# Altium schematic sheet DAC To LP Filter.SchDoc: Audio_Moduloop - DAC/LP-filter
size A; Date: 2/27/2024; DrawnBy: Team 28: Ryan Gordon, Conor Curtin, Evan Roveili, Shawn Colby; DocumentNumber: 3; Revision: V1; SheetNumber: 3; SheetTotal: 9
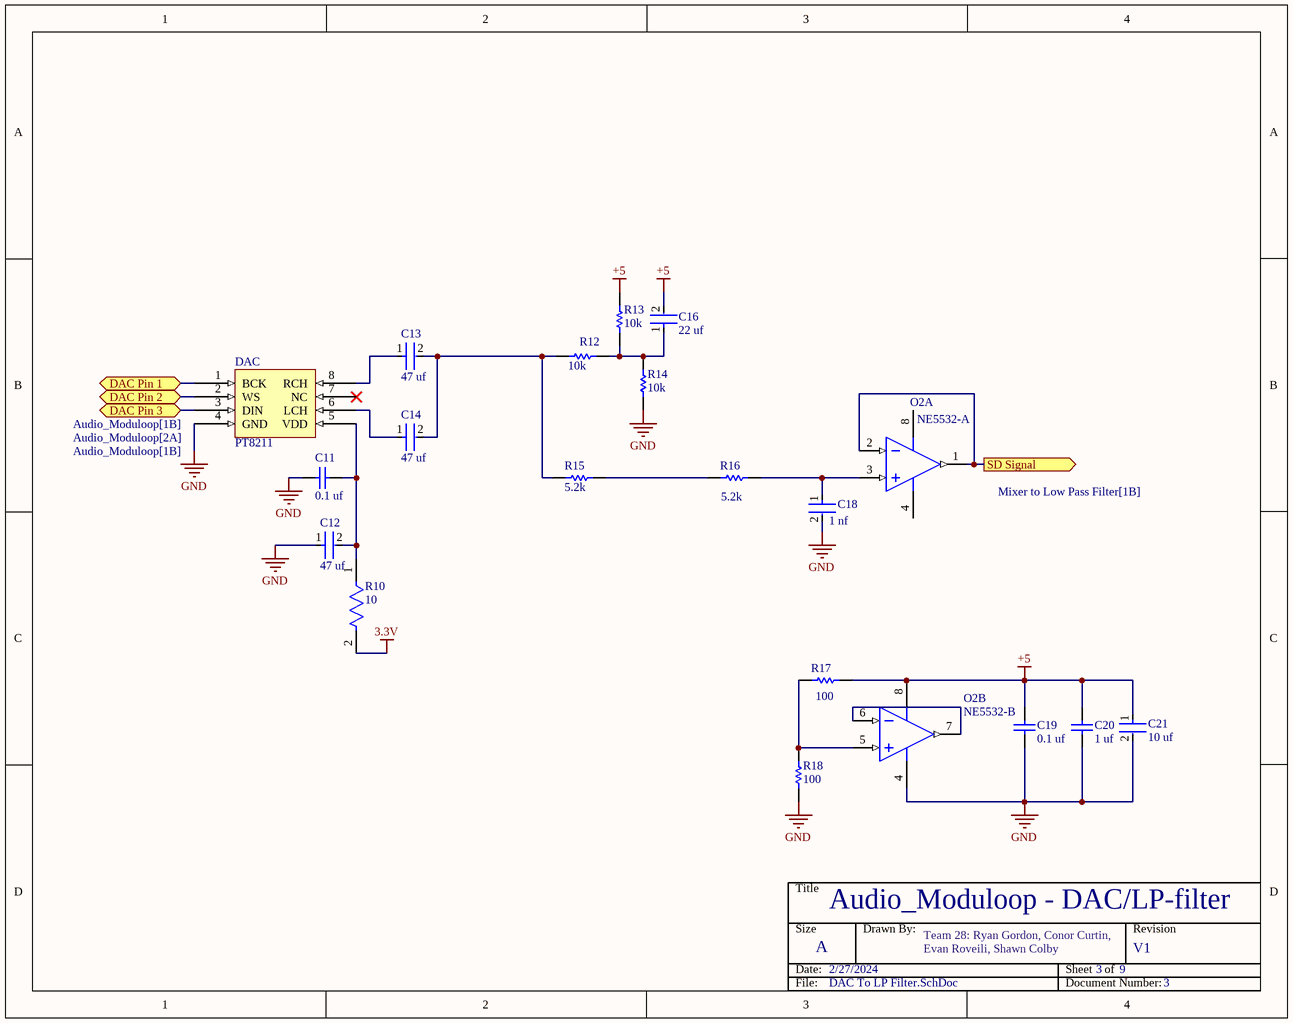
[diagram p0: DAC To LP Filter.SchDoc]

## Parts
C11  0.1 uf  [VISH-K104K15X7RF5TL2]
C12  47 uf  [FP-RCE2A2-MFG]
C13  47 uf  [FP-RCE2A2-MFG]
C14  47 uf  [FP-RCE2A2-MFG]
C16  22 uf  [FP-RCEWM1-MFG]
C18  1 nf  [FP-RCE0DB-MFG]
C19  0.1 uf  [CAPC2013X135X45ML10T25]
C20  1 uf  [CAPC2013X145X50LL20T25]
C21  10 uf  [FP-C0805C-DG-MFG]
DAC  PT8211  [SOIC127P602X173-8N]
O2  NE5532-A  [ONSC-SOIC-8-751-07_V]  (parts A,B of 2)
R10  10  [FP-RN732A-MFG]
R12  10k  [RESC2013X60X35NL10T20]
R13  10k  [RESC2013X60X35NL10T20]
R14  10k  [RESC2013X60X35NL10T20]
R15  5.2k  [RESC2013X70X40LL20T20]
R16  5.2k  [RESC2013X70X40LL20T20]
R17  100  [RESC2013X60X40ML20T25]
R18  100  [RESC2013X60X40ML20T25]

## Ports
DAC Pin 1 (bidir, see Audio_Moduloop[1B]), DAC Pin 2 (bidir, see Audio_Moduloop[1B]), DAC Pin 3 (bidir, see Audio_Moduloop[2A]), SD Signal (out, see Mixer to Low Pass Filter[1B])

## Nets
3.3V: R10.2
+5: C16.2 C19.1 C20.1 C21.1 O2.8(V+) R13.1 R17.2
GND: C11.2 C12.1 C18.2 C19.2 C20.2 C21.2 DAC.4(GND) O2.4(V-) R14.2 R18.1
DAC Pin 1: DAC.1(BCK) ; port DAC Pin 1
DAC Pin 2: DAC.2(WS) ; port DAC Pin 2
DAC Pin 3: DAC.3(DIN) ; port DAC Pin 3
SD Signal: O2.1(OUTA) O2.2(INA-) ; port SD Signal
NetC11_1: C11.1 C12.2 DAC.5(VDD) R10.1
NetC13_1: C13.1 DAC.8(RCH)
NetC13_2: C13.2 C14.2 R12.2 R15.1
NetC14_1: C14.1 DAC.6(LCH)
NetC16_1: C16.1 R12.1 R13.2 R14.1
NetC18_1: C18.1 O2.3(INA+) R16.2
NetO2_5: O2.5(INB+) R17.1 R18.2
NetO2_6: O2.6(INB-) O2.7(OUTB)
NetR15_2: R15.2 R16.1

Not connected (* = marked no-connect by the designer): DAC 7(NC)*

## Notes on the sheet
- Title
- Size
- Date:
- A
- Drawn By:
- Sheet    of
- Revision
- File:
- Document Number:

## Library data of the parts
C11 = CMP-2000-06508-1: Ceramic Capacitor, 100 nF, +/- 10%, 50 V, -55 to 125 degC, 2-Pin THD, RoHS, Tape and Reel; Manufacturer: Vishay; Other Names: BC1084CT; Catalog Drawings: Mono-KapSide2-15_5.58Mono-KapSide1_15; Temperature Coefficient: X7R; Voltage - Rated: 50V; Online Catalog: Mono-Kap™Series; Capacitance: 0.1µF; Size / Dimension: 0.157"Lx0.098"W(4.00mmx2.50mm); Operating Temperature: -55°C~125°C; Family: CeramicCapacitors; Manufacturer URL: http://www.vishay.com/; Standard Package: 1; Thickness (Max): -; Ratings: -; Datasheet Version: 08/2013; Package Description: 2-Pin Through Hole Device, Body 4 x 2.6 mm; Mounting Type: ThroughHole; Features: -; Lead Spacing: 0.098"(2.50mm); Tolerance: ±10%; Category: Capacitors; Mounting Technology: ThroughHole; Lead Style: Straight; Datasheet URL: http://www.vishay.com/docs/45171/kseries.pdf; Applications: GeneralPurpose; Package / Case: Radial; Height - Seated (Max): 0.220"(5.58mm); Package Reference: K104K15X7RF5TL2; Series: Mono-Kap™K; Packaging: CutTape(CT)
C12-C14 = CMP-06035-022497-1: Cap Ceramic 4.7uF 25V X7R ±10% Radial 2.5mm +125°C Automotive Ammo Pack; Lead/Base Style: Straight; Lead Diameter: 0.5mm; Height - Seated (Max): 0.157inch; Voltage Rating (DC): 25V; Height: 4mm; Length: 0.217inch; Max Operating Temperature: 125°C; Ratings: AEC-Q200; Dielectric: X7R; Resistor Type: Ceramic; Packaging: Tape and Reel; Tolerance: 10%; Termination: Radial; Min Operating Temperature: -55°C; Case/Package: Radial; Width: 0.124inch; Lead Pitch: 0.098inch; Package Quantity: 2000; Voltage Rating: 25V; Mount: Through Hole; Capacitance: 4.7uF
C16 = CMP-06035-009422-1: Cap Ceramic 22uF 25V X7R ±20% Radial 5mm +125°C Automotive Ammo Pack; Lead/Base Style: Formed Leads; Lead Diameter: 0.5mm; Packaging: Bulk; Width: 0.157inch; Min Operating Temperature: -55°C; Lead Pitch: 0.197inch; Ratings: AEC-Q200; Length: 0.217inch; Voltage Rating (DC): 25V; Case/Package: Radial; Height - Seated (Max): 0.295inch; Package Quantity: 500; Max Operating Temperature: 125°C; Mount: Through Hole; Resistor Type: Ceramic; Height: 7.5mm; Capacitance: 22uF; Tolerance: 20%; Dielectric: X7R; Voltage Rating: 25V; Termination: Radial
C18 = CMP-06035-009321-1: Cap Ceramic 470pF 100V X7R ±10% Radial 2.5mm +125°C Ammo Pack; Lead Diameter: 0.5mm; Lead/Base Style: Straight; Termination: Radial; Width: 0.098inch; Mount: Through Hole; Package Quantity: 2000; Height - Seated (Max): 0.138inch; Height: 3.5mm; Voltage Rating: 100V; Min Operating Temperature: -55°C; Dielectric: X7R; Max Operating Temperature: 125°C; Voltage Rating (DC): 100V; Capacitance: 470pF; Ratings: AEC-Q200; Packaging: Tape and Reel; Tolerance: 10%; Resistor Type: Ceramic; Lead Pitch: 0.098inch; Case/Package: Radial; Length: 0.142inch
C19 = CMP-2100-03644-1: Chip Capacitor, 0.1 uF, +/- 10%, 50 V, -55 to 125 degC, 0805 (2012 Metric), RoHS, Tape and Reel; Manufacturer: Murata; Voltage: 50V; Capacitance: 100nF; Insulation Resistance: 10GR; Dielectric Material: Ceramic; Dielectric: X7R; Package Description: 2-Pin Surface Mount Device, Body 2 x 1.25 mm; Manufacturer URL: http://www.murata.com/; Case Code (Imperial): 0805; Datasheet URL: http://psearch.en.murata.com/capacitor/product/GRM21BR71H104KA01%23.pdf; Termination: SMD/SMT; Lead Free: LeadFree; Package Quantity: 1; Mount: SurfaceMount; REACH SVHC: Unknown; Thickness: 0.053inch; Height: 1.25mm; Case/Package: 0805; Voltage Rating: 50V; Width: 0.049inch; Case Code (Metric): 2012; Material: Ceramic; Min Operating Temperature: -55degC; RoHSCompliant: true; Datasheet Version: 42675.0; Voltage Rating (DC): 50V; Tolerance: 10%; Package Reference: 0805; Depth: 1.25mm; Length: 2mm; Max Operating Temperature: 125degC; Packaging: TapeandReel; Number of Pins: 2; Radiation Hardening: No
C20 = CMP-1036-04746-2: Manufacturer: Kemet; Part Number: C0805C105K4PACTU
C21 = CMP-2007-03243-2: CAP CER 10UF 10V X5R 0805; Manufacturer Part Number: C0805C106K8PACTU; Manufacturer: Kemet; 3DS Part Number: 220-00001; Tolerance: 10%; Temperature Coefficient: 15%; Material: Ceramic; Device Class L2: Capacitors; Device Class L1: Passive Components; ComponentLink2URL: https://content.kemet.com/datasheets/KEM_C1006_X5R_SMD.pdf; Height: 1.4mm; Lead Free: Yes; Digikey Description: CAP CER 10UF 10V X5R 0805; Octopart: https://octopart.com/c0805c106k8pactu-kemet-98697; Capacitance: 10uF; Value: 10uF; Temperature Range Low: -55°C; Temperature: -55°C to +85°C; Automotive: No; Mouser Description: CAP CER 10UF 10V X5R 0805; Ipc Land Pattern Name: CAPC200125X125; Temperature Range High: +85°C; Voltage: 10V; RoHS: TRUE; Device Class L3: Ceramic Capacitors; ComponentLink2Description: Datasheet; Voltage Rating: 10V; Package: C0805C-DG; Temperature Characteristic: X5R; Category: Cap
DAC = CMP-015-00008-3
O2 = CMP-1310-00252-1: Internally Compensated Dual Low Noise Operational Amplifier, 6 to 40 V, 0 to 70 degC, 8-Pin SOIC, Pb-Free, Tape and Reel; Manufacturer: On Semiconductor; PartNumber: NE5532AD8R2G; SR Typ (V/uS): 9; VCC Min (V): 6; VCC Max (V): 40; GBW Typ (MHz): 10; PackageVersion: Rev. AK, 02/2011; ComponentLink2URL: http://www.onsemi.cn/pub_link/Collateral/NE5532-D.PDF; RoHS: TRUE; PackageReference: SOIC-8-751-07; ComponentLink2Description: Datasheet; PackageDescription: 8-Pin Small Outline Integrated Circuit, Body 4.9 x 3.9 mm, Pitch 1.27 mm; ComponentLink3URL: http://www.onsemi.com/pub_link/Collateral/751-07.PDF; ComponentLink1Description: Manufacturer URL; DatasheetVersion: Rev. 2; Packing: Tape and Reel; ComponentLink1URL: http://www.onsemi.com/; ComponentLink3Description: Package Specification; Mounting Technology: Surface Mount
R10 = CMP-03211-004731-1: SMD Chip Resistor, Thin Film, 10Ω, 100 V, 0805 [2012 Metric], 100 mW, 0.1%, RN73 Series; Manufacturer: TE Connectivity; Manufacturer Part Number: RN73C2A10RBTG; Power Rating: 0.1W; Temperature Coefficient: 10ppm/°C; Voltage Rating: 100V; Device Class L2: Resistors; octopart_url: https://octopart.com/rn73c2a10rbtg-te+connectivity-21412009; Temperature: -55°C to 155°C; Automotive: No; Temperature Range High: 155°C; Device Class L1: Passive Components; Package: RN732A; Value: 10Ω; Lead Free: Yes; Composition: Thin Film; Ipc Land Pattern Name: RESC200125X55; Resistance: 10Ω; RoHS: TRUE; Height: 0.65mm; Series: RN73; Category: Res; ComponentLink2URL: https://www.te.com/commerce/DocumentDelivery/DDEController?Action=showdoc&DocId=Data+Sheet%7F1773270%7FP%7Fpdf%7FEnglish%7FENG_DS_1773270_P.pdf%7F1676162-2; Device Class L3: Chip SMD Resistors; Octopart: https://octopart.com/rn73c2a10rbtg-te+connectivity-21412009; ComponentLink2Description: Datasheet; Temperature Range Low: -55°C; packaging: 250 cut tape length; Tolerance: 0.1%
R12-R14 = CMP-1659-00013-4: Chip Resistor, 10 KOhm, +/- 1%, 0.125 W, -55 to 155 degC, 0805 (2012 Metric), RoHS, Tape and Reel; Manufacturer: Yageo; Voltage Rating: 150 V; Mount: Surface Mount; ComponentLink1Description: Manufacturer URL; ComponentLink2URL: http://www.yageo.com/documents/recent/PYu-RC_Group_51_RoHS_L_04.pdf; Pins: 2; Length: 2 mm; Min Operating Temperature: -55 degC; Height: 0.5 mm; Mounting Technology: Surface Mount; RoHSCompliant: true; REACH SVHC: No SVHC; ComponentLink1URL: http://www.yageo.com/; Max Operating Temperature: 155 degC; PackageReference: 0805; DatasheetVersion: Rev. 4, 02/2016; Package Quantity: 5000; Packaging: Tape and Reel; ComponentLink2Description: Datasheet; PackageDescription: 2-Pin Surface Mounted Device, Body 2 x 1.25 mm
R15 R16 = CMP-2001-00567-1: Manufacturer: Panasonic; Part Number: ERJ6ENF6801V
R17 R18 = CMP-2001-00580-1: Manufacturer: Panasonic; Part Number: ERA6AEB101V